# Altium schematic sheet FAT_File_System.SchDoc
size B
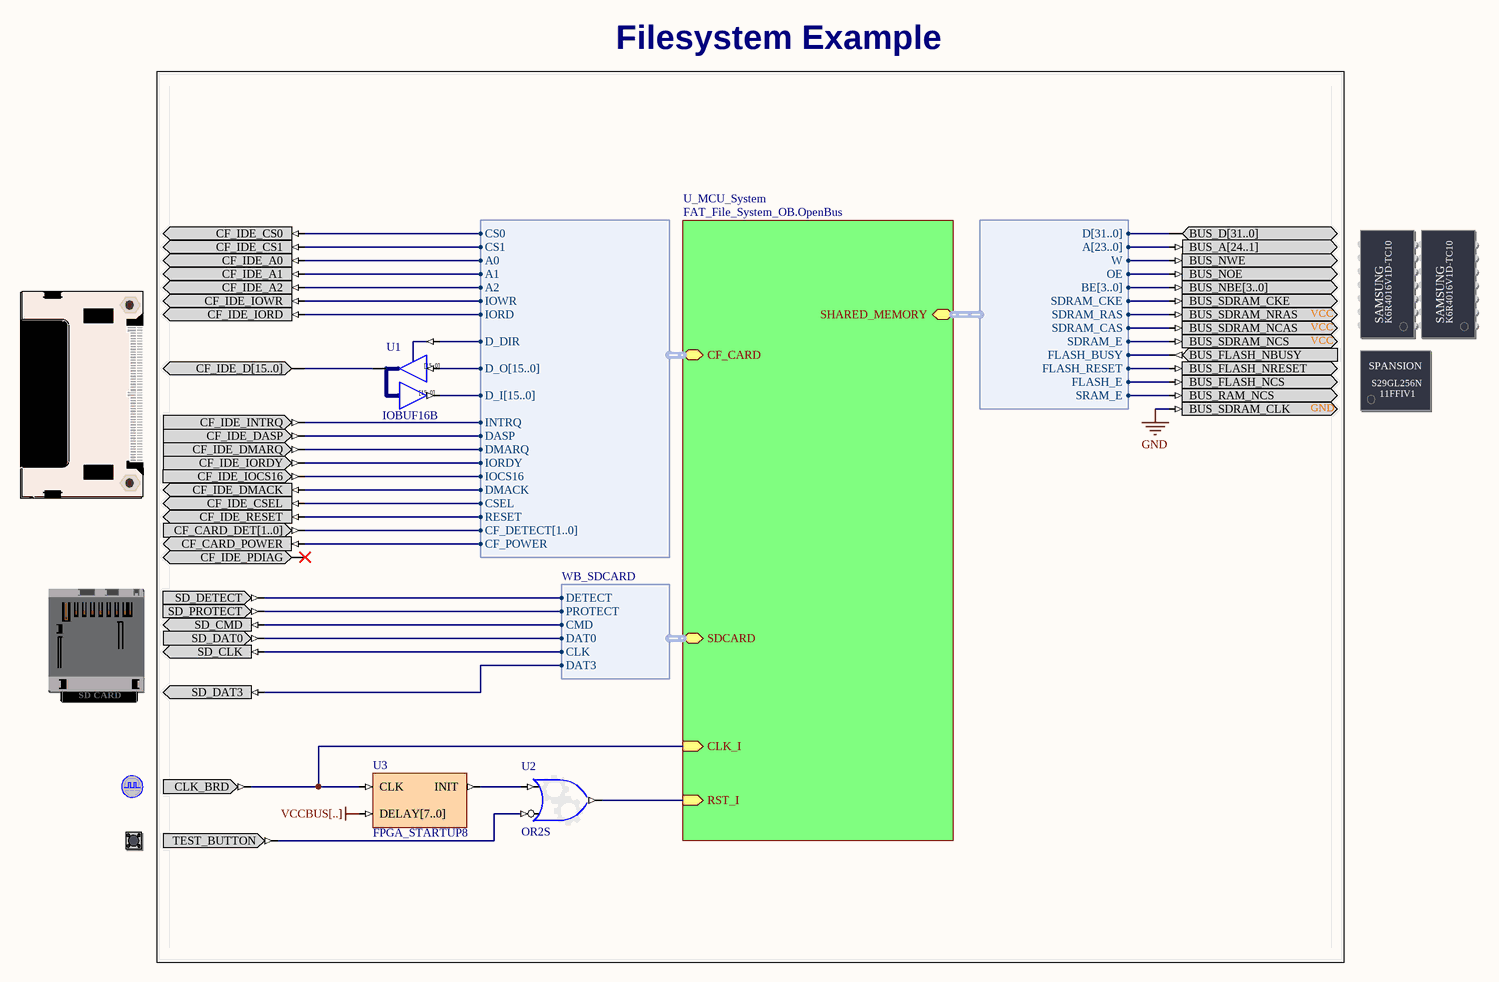
[diagram p0: FAT_File_System.SchDoc]

## Parts
(Parts that share a designator on the sheet are numbered #1, #2 ... from top to bottom, then left to right.)
?#1  COMPACT_FLASH  (value not drawn)
?#2  SHARED_SRAM_FLASH_DAUGHTER  (value not drawn)
?#3  CLOCK_BOARD  (value not drawn)
?#4  TEST_BUTTON  (value not drawn)
SDCARD_READER  SD_CARD  (value not drawn)
U1  IOBUF16B
U2  OR2S
U3  FPGA_STARTUP8

## Blocks framed on the sheet
Filesystem Example: ?#1-?#4 SDCARD_READER U1-U3

## Sub-sheets
U_MCU_System = FAT_File_System_OB.OpenBus: RST_I (in), CLK_I (in), CF_CARD (harness WB_IDE), SHARED_MEMORY (harness WB_SHARED_MEM_CTRL), SDCARD (harness WB_SDCARD)

## Harnesses
WB_IDE: CS0, CS1, A0, A1, A2, IOWR, IORD, D_DIR, D_O[15..0], D_I[15..0], INTRQ, DASP, DMARQ, IORDY, IOCS16, DMACK, CSEL, RESET, CF_DETECT[1..0], CF_POWER
WB_SHARED_MEM_CTRL: D[31..0], A[23..0], W, OE, BE[3..0], SDRAM_CKE, SDRAM_RAS, SDRAM_CAS, SDRAM_E, FLASH_BUSY, FLASH_RESET, FLASH_E, SRAM_E
WB_SDCARD: DETECT, PROTECT, CMD, DAT0, CLK, DAT3

## Nets
GND: ?#2.BUS_SDRAM_CLK
VCCBUS[..]: U3.DELAY[7..0]
Net?#1_CF_CARD_DET[1..0]: ?#1.CF_CARD_DET[1..0] ; sheet U_MCU_System/CF_CARD.CF_DETECT[1..0]
Net?#1_CF_CARD_POWER: ?#1.CF_CARD_POWER ; sheet U_MCU_System/CF_CARD.CF_POWER
Net?#1_CF_IDE_A0: ?#1.CF_IDE_A0 ; sheet U_MCU_System/CF_CARD.A0
Net?#1_CF_IDE_A1: ?#1.CF_IDE_A1 ; sheet U_MCU_System/CF_CARD.A1
Net?#1_CF_IDE_A2: ?#1.CF_IDE_A2 ; sheet U_MCU_System/CF_CARD.A2
Net?#1_CF_IDE_CS0: ?#1.CF_IDE_CS0 ; sheet U_MCU_System/CF_CARD.CS0
Net?#1_CF_IDE_CS1: ?#1.CF_IDE_CS1 ; sheet U_MCU_System/CF_CARD.CS1
Net?#1_CF_IDE_CSEL: ?#1.CF_IDE_CSEL ; sheet U_MCU_System/CF_CARD.CSEL
Net?#1_CF_IDE_D[15..0]: ?#1.CF_IDE_D[15..0] U1.IO[15..0]
Net?#1_CF_IDE_DASP: ?#1.CF_IDE_DASP ; sheet U_MCU_System/CF_CARD.DASP
Net?#1_CF_IDE_DMACK: ?#1.CF_IDE_DMACK ; sheet U_MCU_System/CF_CARD.DMACK
Net?#1_CF_IDE_DMARQ: ?#1.CF_IDE_DMARQ ; sheet U_MCU_System/CF_CARD.DMARQ
Net?#1_CF_IDE_INTRQ: ?#1.CF_IDE_INTRQ ; sheet U_MCU_System/CF_CARD.INTRQ
Net?#1_CF_IDE_IOCS16: ?#1.CF_IDE_IOCS16 ; sheet U_MCU_System/CF_CARD.IOCS16
Net?#1_CF_IDE_IORD: ?#1.CF_IDE_IORD ; sheet U_MCU_System/CF_CARD.IORD
Net?#1_CF_IDE_IORDY: ?#1.CF_IDE_IORDY ; sheet U_MCU_System/CF_CARD.IORDY
Net?#1_CF_IDE_IOWR: ?#1.CF_IDE_IOWR ; sheet U_MCU_System/CF_CARD.IOWR
Net?#1_CF_IDE_RESET: ?#1.CF_IDE_RESET ; sheet U_MCU_System/CF_CARD.RESET
Net?#2_BUS_A[24..1]: ?#2.BUS_A[24..1] ; sheet U_MCU_System/SHARED_MEMORY.A[23..0]
Net?#2_BUS_D[31..0]: ?#2.BUS_D[31..0] ; sheet U_MCU_System/SHARED_MEMORY.D[31..0]
Net?#2_BUS_FLASH_NBUSY: ?#2.BUS_FLASH_NBUSY ; sheet U_MCU_System/SHARED_MEMORY.FLASH_BUSY
Net?#2_BUS_FLASH_NCS: ?#2.BUS_FLASH_NCS ; sheet U_MCU_System/SHARED_MEMORY.FLASH_E
Net?#2_BUS_FLASH_NRESET: ?#2.BUS_FLASH_NRESET ; sheet U_MCU_System/SHARED_MEMORY.FLASH_RESET
Net?#2_BUS_NBE[3..0]: ?#2.BUS_NBE[3..0] ; sheet U_MCU_System/SHARED_MEMORY.BE[3..0]
Net?#2_BUS_NOE: ?#2.BUS_NOE ; sheet U_MCU_System/SHARED_MEMORY.OE
Net?#2_BUS_NWE: ?#2.BUS_NWE ; sheet U_MCU_System/SHARED_MEMORY.W
Net?#2_BUS_RAM_NCS: ?#2.BUS_RAM_NCS ; sheet U_MCU_System/SHARED_MEMORY.SRAM_E
Net?#2_BUS_SDRAM_CKE: ?#2.BUS_SDRAM_CKE ; sheet U_MCU_System/SHARED_MEMORY.SDRAM_CKE
Net?#2_BUS_SDRAM_NCAS: ?#2.BUS_SDRAM_NCAS ; sheet U_MCU_System/SHARED_MEMORY.SDRAM_CAS
Net?#2_BUS_SDRAM_NCS: ?#2.BUS_SDRAM_NCS ; sheet U_MCU_System/SHARED_MEMORY.SDRAM_E
Net?#2_BUS_SDRAM_NRAS: ?#2.BUS_SDRAM_NRAS ; sheet U_MCU_System/SHARED_MEMORY.SDRAM_RAS
Net?#3_CLK_BRD: ?#3.CLK_BRD U3.CLK ; sheet U_MCU_System/CLK_I
Net?#4_TEST_BUTTON: ?#4.TEST_BUTTON U2.I1
NetSDCARD_READER_SD_CLK: SDCARD_READER.SD_CLK ; sheet U_MCU_System/SDCARD.CLK
NetSDCARD_READER_SD_CMD: SDCARD_READER.SD_CMD ; sheet U_MCU_System/SDCARD.CMD
NetSDCARD_READER_SD_DAT0: SDCARD_READER.SD_DAT0 ; sheet U_MCU_System/SDCARD.DAT0
NetSDCARD_READER_SD_DAT3: SDCARD_READER.SD_DAT3 ; sheet U_MCU_System/SDCARD.DAT3
NetSDCARD_READER_SD_DETECT: SDCARD_READER.SD_DETECT ; sheet U_MCU_System/SDCARD.DETECT
NetSDCARD_READER_SD_PROTECT: SDCARD_READER.SD_PROTECT ; sheet U_MCU_System/SDCARD.PROTECT
NetU1_I[15..0]: U1.I[15..0] ; sheet U_MCU_System/CF_CARD.D_O[15..0]
NetU1_O[15..0]: U1.O[15..0] ; sheet U_MCU_System/CF_CARD.D_I[15..0]
NetU1_T: U1.T ; sheet U_MCU_System/CF_CARD.D_DIR
NetU2_I0: U2.I0 U3.INIT
NetU2_O: U2.O ; sheet U_MCU_System/RST_I

Not connected (* = marked no-connect by the designer): ?#1 CF_IDE_PDIAG*

## Notes on the sheet
- Title
- Size:
- Date:
- B
- Number:
- Time:
- Revision:
- Sheet
- of
- File:
- (in symbol IOBUF16B) [15..0]
- (in symbol SD_CARD) SD CARD
- (in symbol SHARED_SRAM_FLASH_DAUGHTER) VCC; SAMSUNG; K6R4016V1D-TC10; SPANSION; S29GL256N; 11FFIV1; GND

## Library data of the parts
?#1 = COMPACT_FLASH: Connector, Compact Flash Card Ejector 22mm; PortComponent: True; Published: 22-Jan-2007; Publisher: Altium Limited; HelpURL: TR0146 Technical Reference for Altium's Mass Storage Peripheral Board PB02.pdf#page=8
?#2 = SHARED_SRAM_FLASH_DAUGHTER: Common-Bus SRAM Flash- Daughterboard; PortComponent: True; Published: 14-May-2007; Publisher: Altium Limited; HelpURL: TR0149 Technical Reference for Altium's Xilinx Spartan-3 Daughter Board DB30.pdf#page=15
?#3 = CLOCK_BOARD: Global System Clock Supply; PortComponent: True; Published: 19-Nov-2003; Publisher: Altium Limited; HelpURL: TR0143 Technical Reference Manual for Altium's Desktop NanoBoard NB2DSK01.pdf#page=41; UseInDSF: True
?#4 = TEST_BUTTON: Test / Reset Button; PortComponent: True; Published: 19-Nov-2003; Publisher: Altium Limited; HelpURL: TR0143 Technical Reference Manual for Altium's Desktop NanoBoard NB2DSK01.pdf#page=53
SDCARD_READER = SD_CARD: Secure Digital Card Socket; PortComponent: True; Published: 22-Jan-2007; Publisher: Altium Limited; UseInDSF: True; HelpURL: TR0146 Technical Reference for Altium's Mass Storage Peripheral Board PB02.pdf#page=7
U1 = IOBUF16B: 16-Bit Input/Output Buffer, Bus Version; SubClass: IOBUF; Enable: Low; Control: Common Control T; PortSize: 16; ArchiveName: GENERIC; VHDLIB_SIM: GENERIC_LIB; Published: 29-Jan-2004; Publisher: Altium Limited; LastRevisionNo: 1.00.00; HelpURL: CR0118 FPGA Generic Library Guide.pdf#page=292; ComponentLink1URL: CR0125 FPGA Buffer Resource Usage.pdf#page=91; ComponentLink1Description: Core &Resource Usage; FunctionalClass: Buffer; PortStyle: Bus Version
U2 = GATE: Configurable Generic Gate; ConfiguratorName: GENERIC_GATE; ConfigurationParameters: {}Version[1.0]{}GateKind[OR]{}BusInput[False]{}GateInputType[Bit]{}GateOutputOption[Normal]{}BusWidth[8]{}RegisterOutputs[False]{}NegativeClockEdge[False]{}InputCount[2]{}InputInvert0[False]{}InputInvert1[True]{}; LastRevisionNo: 1.00.00; Published: 3-Sep-2008; Publisher: Altium Limited
U3 = FPGA_STARTUP8: FPGA Startup With 8 Bit Delay; Published: 9-Dec-2004; Publisher: Altium Limited; HelpURL: CR0119 FPGA_STARTUPx Powerup Delay Unit.pdf; LastRevisionNo: 1.00.00; ComponentLink1Description: Core &Resource Usage; ComponentLink1URL: CR0139 FPGA Peripheral Resource Usage.pdf#page=11